# EAGLE schematic Inputs (EAGLE 9.3.2)
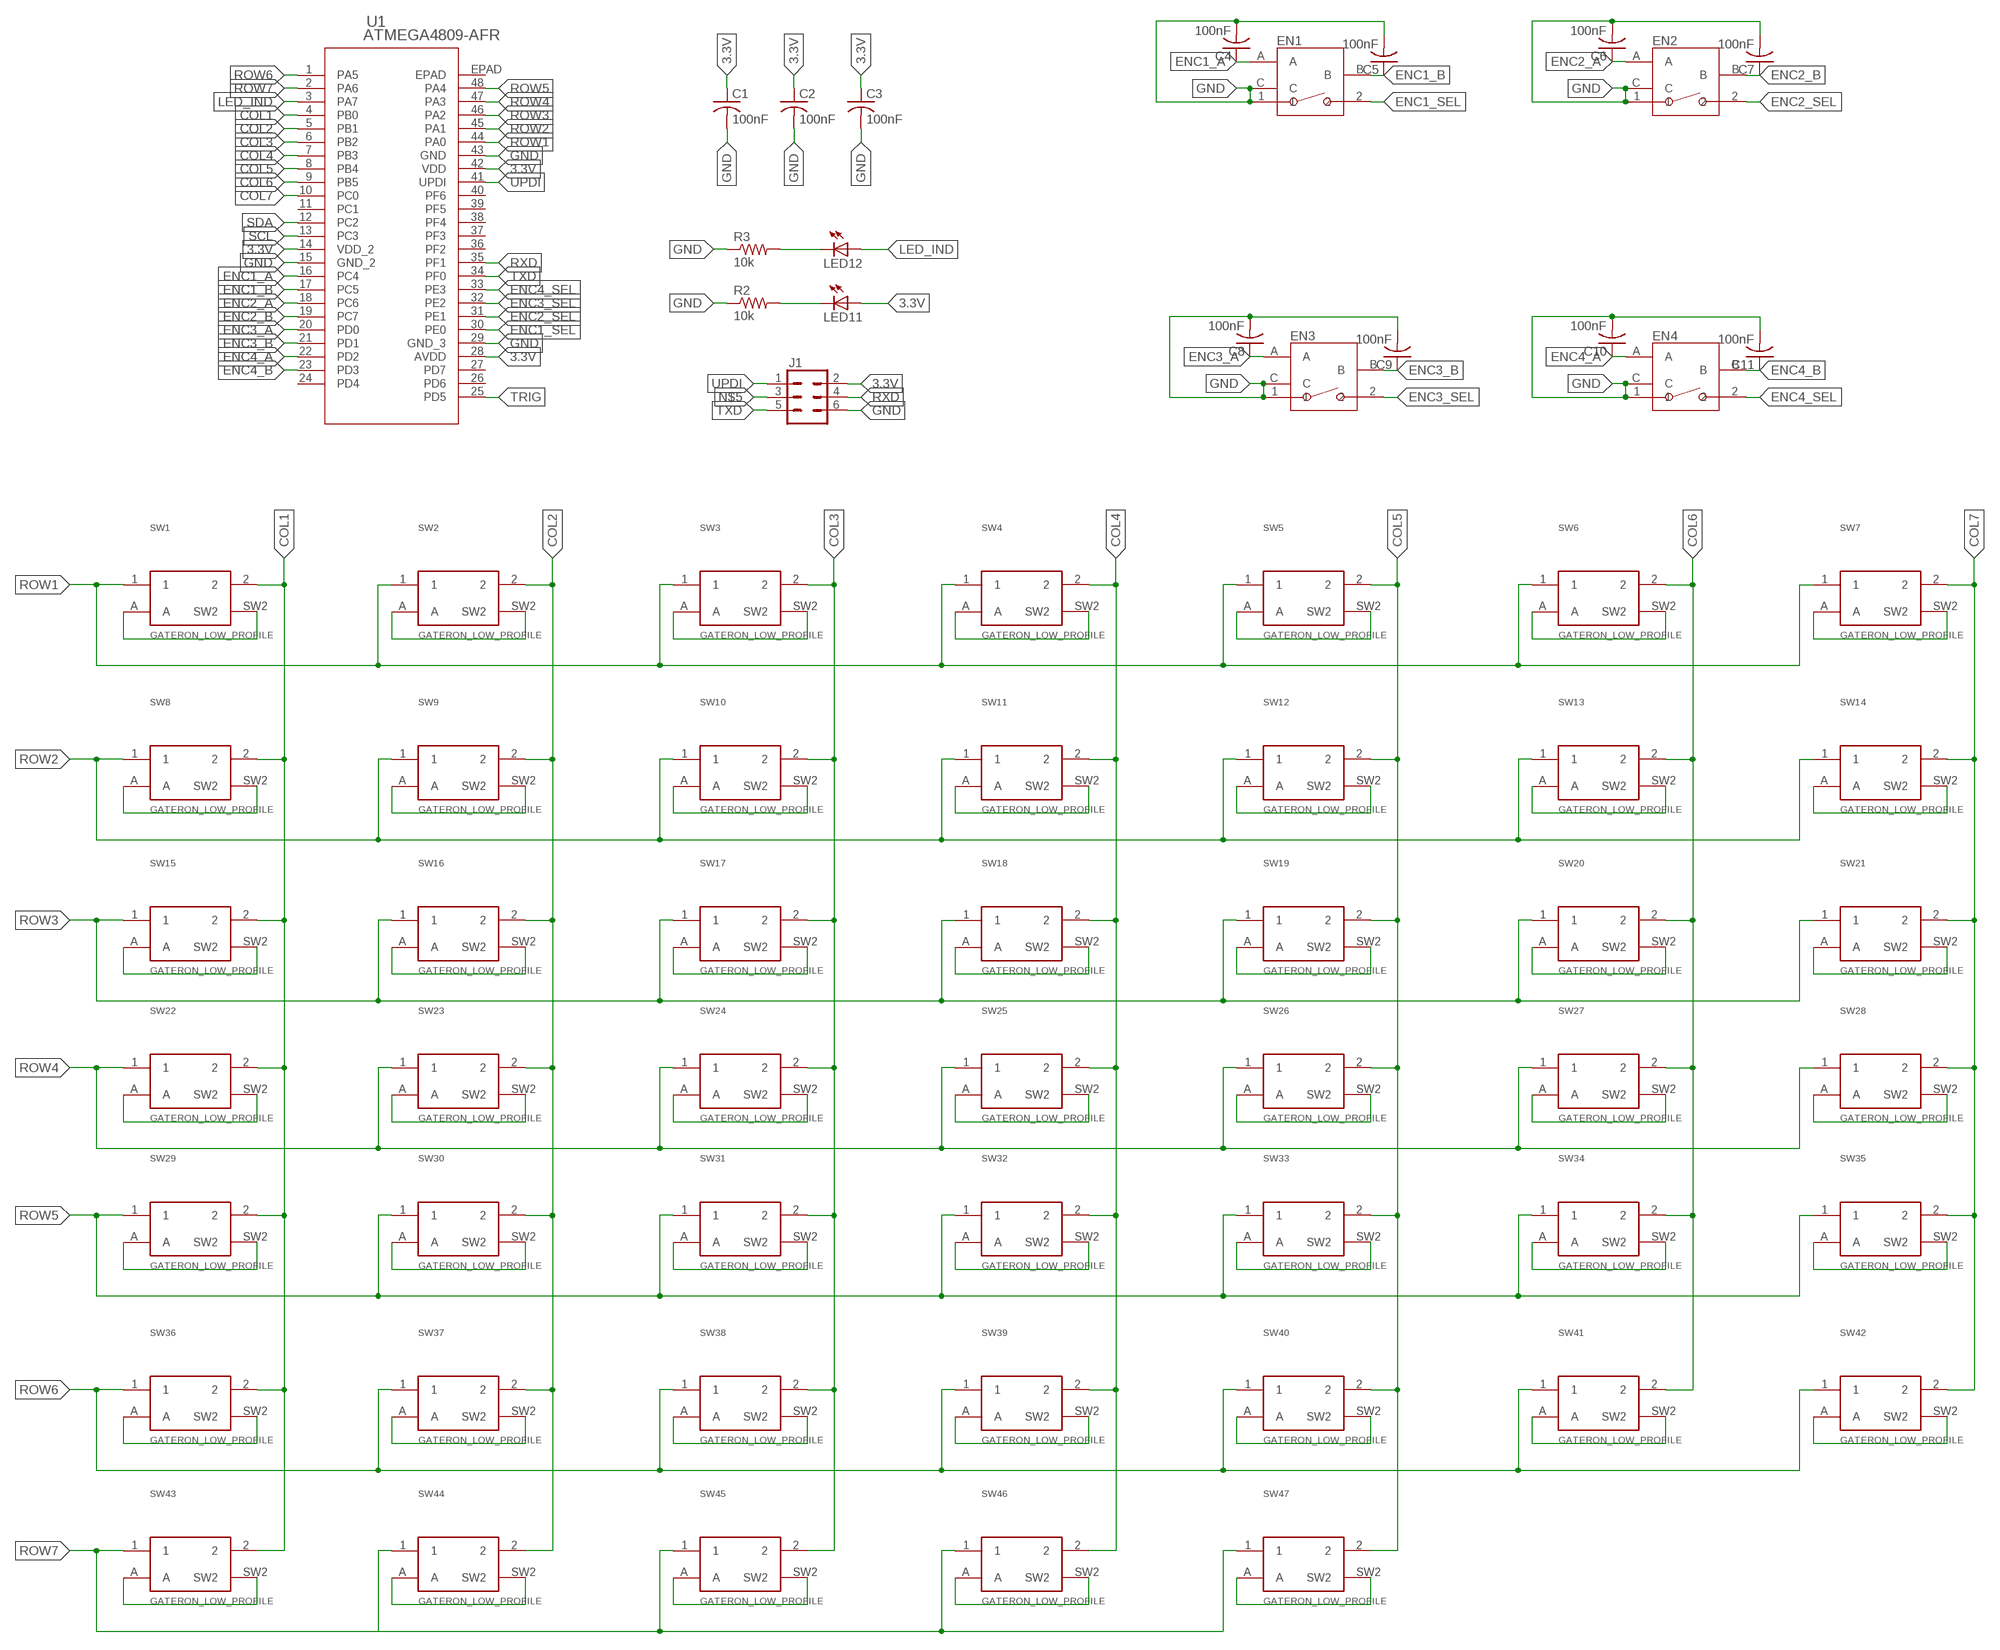
[diagram p0: schematic, sheet 1]

## Parts
C1  100nF  C-USC0805  [C0805]
C2  100nF  C-USC0805  [C0805]
C3  100nF  C-USC0805  [C0805]
C4  100nF  C-USC0805  [C0805]
C5  100nF  C-USC0805  [C0805]
C6  100nF  C-USC0805  [C0805]
C7  100nF  C-USC0805  [C0805]
C8  100nF  C-USC0805  [C0805]
C9  100nF  C-USC0805  [C0805]
C10  100nF  C-USC0805  [C0805]
C11  100nF  C-USC0805  [C0805]
EN1  PEC11R-4215K-S0024  [PEC11R-4215K-S0024]
EN2  PEC11R-4215K-S0024  [PEC11R-4215K-S0024]
EN3  PEC11R-4215K-S0024  [PEC11R-4215K-S0024]
EN4  PEC11R-4215K-S0024  [PEC11R-4215K-S0024]
J1  CONN_03X2FEMALE_SMD  [2X3_SMD]
LED11  LEDCHIPLED_0805  [CHIPLED_0805]
LED12  LEDCHIPLED_0805  [CHIPLED_0805]
R2  10k  R-US_R0805  [R0805]
R3  10k  R-US_R0805  [R0805]
SW1  GATERON_LOW_PROFILE  [GATERON_LP_PLAIN]
SW2  GATERON_LOW_PROFILE  [GATERON_LP_PLAIN]
SW3  GATERON_LOW_PROFILE  [GATERON_LP_PLAIN]
SW4  GATERON_LOW_PROFILE  [GATERON_LP_PLAIN]
SW5  GATERON_LOW_PROFILE  [GATERON_LP_PLAIN]
SW6  GATERON_LOW_PROFILE  [GATERON_LP_PLAIN]
SW7  GATERON_LOW_PROFILE  [GATERON_LP_PLAIN]
SW8  GATERON_LOW_PROFILE  [GATERON_LP_PLAIN]
SW9  GATERON_LOW_PROFILE  [GATERON_LP_PLAIN]
SW10  GATERON_LOW_PROFILE  [GATERON_LP_PLAIN]
SW11  GATERON_LOW_PROFILE  [GATERON_LP_PLAIN]
SW12  GATERON_LOW_PROFILE  [GATERON_LP_PLAIN]
SW13  GATERON_LOW_PROFILE  [GATERON_LP_PLAIN]
SW14  GATERON_LOW_PROFILE  [GATERON_LP_PLAIN]
SW15  GATERON_LOW_PROFILE  [GATERON_LP_PLAIN]
SW16  GATERON_LOW_PROFILE  [GATERON_LP_PLAIN]
SW17  GATERON_LOW_PROFILE  [GATERON_LP_PLAIN]
SW18  GATERON_LOW_PROFILE  [GATERON_LP_PLAIN]
SW19  GATERON_LOW_PROFILE  [GATERON_LP_PLAIN]
SW20  GATERON_LOW_PROFILE  [GATERON_LP_PLAIN]
SW21  GATERON_LOW_PROFILE  [GATERON_LP_PLAIN]
SW22  GATERON_LOW_PROFILE  [GATERON_LP_PLAIN]
SW23  GATERON_LOW_PROFILE  [GATERON_LP_PLAIN]
SW24  GATERON_LOW_PROFILE  [GATERON_LP_PLAIN]
SW25  GATERON_LOW_PROFILE  [GATERON_LP_PLAIN]
SW26  GATERON_LOW_PROFILE  [GATERON_LP_PLAIN]
SW27  GATERON_LOW_PROFILE  [GATERON_LP_PLAIN]
SW28  GATERON_LOW_PROFILE  [GATERON_LP_PLAIN]
SW29  GATERON_LOW_PROFILE  [GATERON_LP_PLAIN]
SW30  GATERON_LOW_PROFILE  [GATERON_LP_PLAIN]
SW31  GATERON_LOW_PROFILE  [GATERON_LP_PLAIN]
SW32  GATERON_LOW_PROFILE  [GATERON_LP_PLAIN]
SW33  GATERON_LOW_PROFILE  [GATERON_LP_PLAIN]
SW34  GATERON_LOW_PROFILE  [GATERON_LP_PLAIN]
SW35  GATERON_LOW_PROFILE  [GATERON_LP_PLAIN]
SW36  GATERON_LOW_PROFILE  [GATERON_LP_PLAIN]
SW37  GATERON_LOW_PROFILE  [GATERON_LP_PLAIN]
SW38  GATERON_LOW_PROFILE  [GATERON_LP_PLAIN]
SW39  GATERON_LOW_PROFILE  [GATERON_LP_PLAIN]
SW40  GATERON_LOW_PROFILE  [GATERON_LP_PLAIN]
SW41  GATERON_LOW_PROFILE  [GATERON_LP_PLAIN]
SW42  GATERON_LOW_PROFILE  [GATERON_LP_PLAIN]
SW43  GATERON_LOW_PROFILE  [GATERON_LP_PLAIN]
SW44  GATERON_LOW_PROFILE  [GATERON_LP_PLAIN]
SW45  GATERON_LOW_PROFILE  [GATERON_LP_PLAIN]
SW46  GATERON_LOW_PROFILE  [GATERON_LP_PLAIN]
SW47  GATERON_LOW_PROFILE  [GATERON_LP_PLAIN]
U1  ATMEGA4809-AFR  [TQFP48_7X7MC_MCH]

## Nets
3.3V: C1.1 C2.1 C3.1 J1.2 LED11.A U1.14(VDD_2) U1.28(AVDD) U1.42(VDD)
COL1: SW1.2 SW8.2 SW15.2 SW22.2 SW29.2 SW36.2 SW43.2 U1.4(PB0)
COL2: SW2.2 SW9.2 SW16.2 SW23.2 SW30.2 SW37.2 SW44.2 U1.5(PB1)
COL3: SW3.2 SW10.2 SW17.2 SW24.2 SW31.2 SW38.2 SW45.2 U1.6(PB2)
COL4: SW4.2 SW11.2 SW18.2 SW25.2 SW32.2 SW39.2 SW46.2 U1.7(PB3)
COL5: SW5.2 SW12.2 SW19.2 SW26.2 SW33.2 SW40.2 SW47.2 U1.8(PB4)
COL6: SW6.2 SW13.2 SW20.2 SW27.2 SW34.2 SW41.2 U1.9(PB5)
COL7: SW7.2 SW14.2 SW21.2 SW28.2 SW35.2 SW42.2 U1.10(PC0)
ENC1_A: C4.1 EN1.A U1.16(PC4)
ENC1_B: C5.1 EN1.B U1.17(PC5)
ENC1_SEL: EN1.2 U1.30(PE0)
ENC2_A: C6.1 EN2.A U1.18(PC6)
ENC2_B: C7.1 EN2.B U1.19(PC7)
ENC2_SEL: EN2.2 U1.31(PE1)
ENC3_A: C8.1 EN3.A U1.20(PD0)
ENC3_B: C9.1 EN3.B U1.21(PD1)
ENC3_SEL: EN3.2 U1.32(PE2)
ENC4_A: C10.1 EN4.A U1.22(PD2)
ENC4_B: C11.1 EN4.B U1.23(PD3)
ENC4_SEL: EN4.2 U1.33(PE3)
GND: C1.2 C2.2 C3.2 C4.2 C5.2 C6.2 C7.2 C8.2 C9.2 C10.2 C11.2 EN1.1 EN1.C EN2.1 EN2.C EN3.1 EN3.C EN4.1 EN4.C J1.6 R2.1 R3.1 U1.15(GND_2) U1.29(GND_3) U1.43(GND)
LED_IND: LED12.A U1.3(PA7)
N$5: J1.3
N$12: SW1.A SW1.SW2
N$14: SW2.A SW2.SW2
N$15: SW3.A SW3.SW2
N$16: SW4.A SW4.SW2
N$17: SW5.A SW5.SW2
N$18: SW6.A SW6.SW2
N$19: SW7.A SW7.SW2
N$20: SW8.A SW8.SW2
N$21: SW9.A SW9.SW2
N$22: SW10.A SW10.SW2
N$23: SW11.A SW11.SW2
N$24: SW12.A SW12.SW2
N$25: SW13.A SW13.SW2
N$26: SW14.A SW14.SW2
N$27: SW15.A SW15.SW2
N$28: SW16.A SW16.SW2
N$29: SW17.A SW17.SW2
N$30: SW18.A SW18.SW2
N$31: SW19.A SW19.SW2
N$32: SW20.A SW20.SW2
N$33: SW21.A SW21.SW2
N$34: SW22.A SW22.SW2
N$35: SW23.A SW23.SW2
N$36: SW24.A SW24.SW2
N$37: SW25.A SW25.SW2
N$38: SW26.A SW26.SW2
N$39: SW27.A SW27.SW2
N$40: SW28.A SW28.SW2
N$41: SW29.A SW29.SW2
N$42: SW30.A SW30.SW2
N$43: SW31.A SW31.SW2
N$44: SW32.A SW32.SW2
N$45: SW33.A SW33.SW2
N$46: SW34.A SW34.SW2
N$47: SW35.A SW35.SW2
N$48: SW36.A SW36.SW2
N$49: SW37.A SW37.SW2
N$50: SW38.A SW38.SW2
N$51: SW39.A SW39.SW2
N$52: SW40.A SW40.SW2
N$53: SW41.A SW41.SW2
N$54: SW42.A SW42.SW2
N$55: SW43.A SW43.SW2
N$56: SW44.A SW44.SW2
N$57: SW45.A SW45.SW2
N$58: SW46.A SW46.SW2
N$59: SW47.A SW47.SW2
N$60: LED12.C R3.2
N$61: LED11.C R2.2
ROW1: SW1.1 SW2.1 SW3.1 SW4.1 SW5.1 SW6.1 SW7.1 U1.44(PA0)
ROW2: SW8.1 SW9.1 SW10.1 SW11.1 SW12.1 SW13.1 SW14.1 U1.45(PA1)
ROW3: SW15.1 SW16.1 SW17.1 SW18.1 SW19.1 SW20.1 SW21.1 U1.46(PA2)
ROW4: SW22.1 SW23.1 SW24.1 SW25.1 SW26.1 SW27.1 SW28.1 U1.47(PA3)
ROW5: SW29.1 SW30.1 SW31.1 SW32.1 SW33.1 SW34.1 SW35.1 U1.48(PA4)
ROW6: SW36.1 SW37.1 SW38.1 SW39.1 SW40.1 SW41.1 SW42.1 U1.1(PA5)
ROW7: SW43.1 SW44.1 SW45.1 SW46.1 SW47.1 U1.2(PA6)
RXD: J1.4 U1.35(PF1)
SCL: U1.13(PC3)
SDA: U1.12(PC2)
TRIG: U1.25(PD5)
TXD: J1.5 U1.34(PF0)
UPDI: J1.1 U1.41(UPDI)
Unconnected: U1.11(PC1) U1.24(PD4) U1.26(PD6) U1.27(PD7) U1.36(PF2) U1.37(PF3) U1.38(PF4) U1.39(PF5) U1.40(PF6) U1.EPAD

## Library data of the parts
C1-C11 = adafruit:C-US: CAPACITOR, American symbol
EN1-EN4 = Encoders:PEC11R-4215K-S0024: ROTARY ENCODER MECHANICAL 24PPR Manufacturer's datasheet <https://www.bourns.com/docs/Product-Datasheets/PEC11R.pdf>; CREATED_BY: PCBLayout.com; DIGIKEY_PARTNO: PEC11R-4215K-S0024-ND; MANUFACTURER: Bourns Inc.; MPN: PEC11R-4215K-S0024; SPICEPREFIX: X
J1 = SparkFun-Connectors:CONN_03X2: Multi connection point. Often used as Generic Header-pin footprint for 0.1 inch spaced/style header connections You can populate with any combo of single row headers, but if you'd like an exact match, check these: Header - 2x3 (Male, 0.1") <https://www.sparkfun.com/products/12807> (PRT-12807) Header - 2x3 (Female, 0.1") <https://www.sparkfun.com/products/13010> (PRT-13010) 2x3 Pin Shrouded Header <https://www.sparkfun.com/products/10877> (PRT-10877) On any of the 0.1 inch spaced packages, you can populate with these: Break Away Headers - Straight <https://www.sparkfun.com/products/116> (PRT-00116) Break Away Male Headers - Right Angle <https://www.sparkfun.com/products/553> (PRT-00553) Female Headers <https://www.sparkfun.com/products/115> (PRT-00115) Break Away Headers - Machine Pin <https://www.sparkfun.com/products/117> (PRT-00117) Break Away Female Headers - Swiss Machine Pin <https://www.sparkfun.com/products/743> (PRT-00743) Special note: the shrouded connector mates well with our 3x2 ribbon cables: Ribbon Crimp Connector - 6-pin (2x3, Female) <https://www.sparkfun.com/products/10651> (PRT-10651) Ribbon Cable - 6 wire (15ft) <https://www.sparkfun.com/products/10646> (PRT-10646); PROD_ID: CONN-11290
LED11 LED12 = adafruit:LED: LED OSRAM: - CHIPLED LG R971, LG N971, LY N971, LG Q971, LY Q971, LO R971, LY R971 LH N974, LH R974 LS Q976, LO Q976, LY Q976 LO Q996 - Hyper CHIPLED LW Q18S LB Q993, LB Q99A, LB R99A - SideLED LS A670, LO A670, LY A670, LG A670, LP A670 LB A673, LV A673, LT A673, LW A673 LH A674 LY A675 LS A676, LA A676, LO A676, LY A676, LW A676 LS A679, LY A679, LG A679 - Hyper Micro SIDELED® LS Y876, LA Y876, LO Y876, LY Y876 LT Y87S - SmartLED LW L88C, LW L88S LB L89C, LB L89S, LG L890 LS L89K, LO L89K, LY L89K LS L896, LA L896, LO L896, LY L896 - TOPLED LS T670, LO T670, LY T670, LG T670, LP T670 LSG T670, LSP T670, LSY T670, LOP T670, LYG T670 LG T671, LOG T671, LSG T671 LB T673, LV T673, LT T673, LW T673 LH T674 LS T676, LA T676, LO T676, LY T676, LB T676, LH T676, LSB T676, LW T676 LB T67C, LV T67C, LT T67C, LS T67K, LO T67K, LY T67K, LW E67C LS E67B, LA E67B, LO E67B, LY E67B, LB E67C, LV E67C, LT E67C LW T67C LS T679, LY T679, LG T679 LS T770, LO T770, LY T770, LG T770, LP T770 LB T773, LV T773, LT T773, LW T773 LH T774 LS E675, LA E675, LY E675, LS T675 LS T776, LA T776, LO T776, LY T776, LB T776 LHGB T686 LT T68C, LB T68C - Hyper Mini TOPLED® LB M676 - Mini TOPLED Santana® LG M470 LS M47K, LO M47K, LY M47K Source: http://www.osram.convergy.de/
R2 R3 = audio amplifier example:R-US_: RESISTOR, American symbol
SW1-SW47 = GateronLowProfile:GATERON_LOW_PROFILE
U1 = ATMEGA4809:ATMEGA4809-AFR; BUILT_BY: EMA_Jessica; COPYRIGHT: Copyright (C) 2018 Accelerated Designs. All rights reserved; MANUFACTURER_PART_NUMBER: ATMEGA4809-AFR; SOURCELIBRARY: Microchip_2019-12-30; VENDOR: Microchip